# Altium project SixSwitchRectifier.PrjPcb (part 2 of 2)

## Sheet Controller.SchDoc
size A4; SheetNumber: 8; SheetTotal: 8
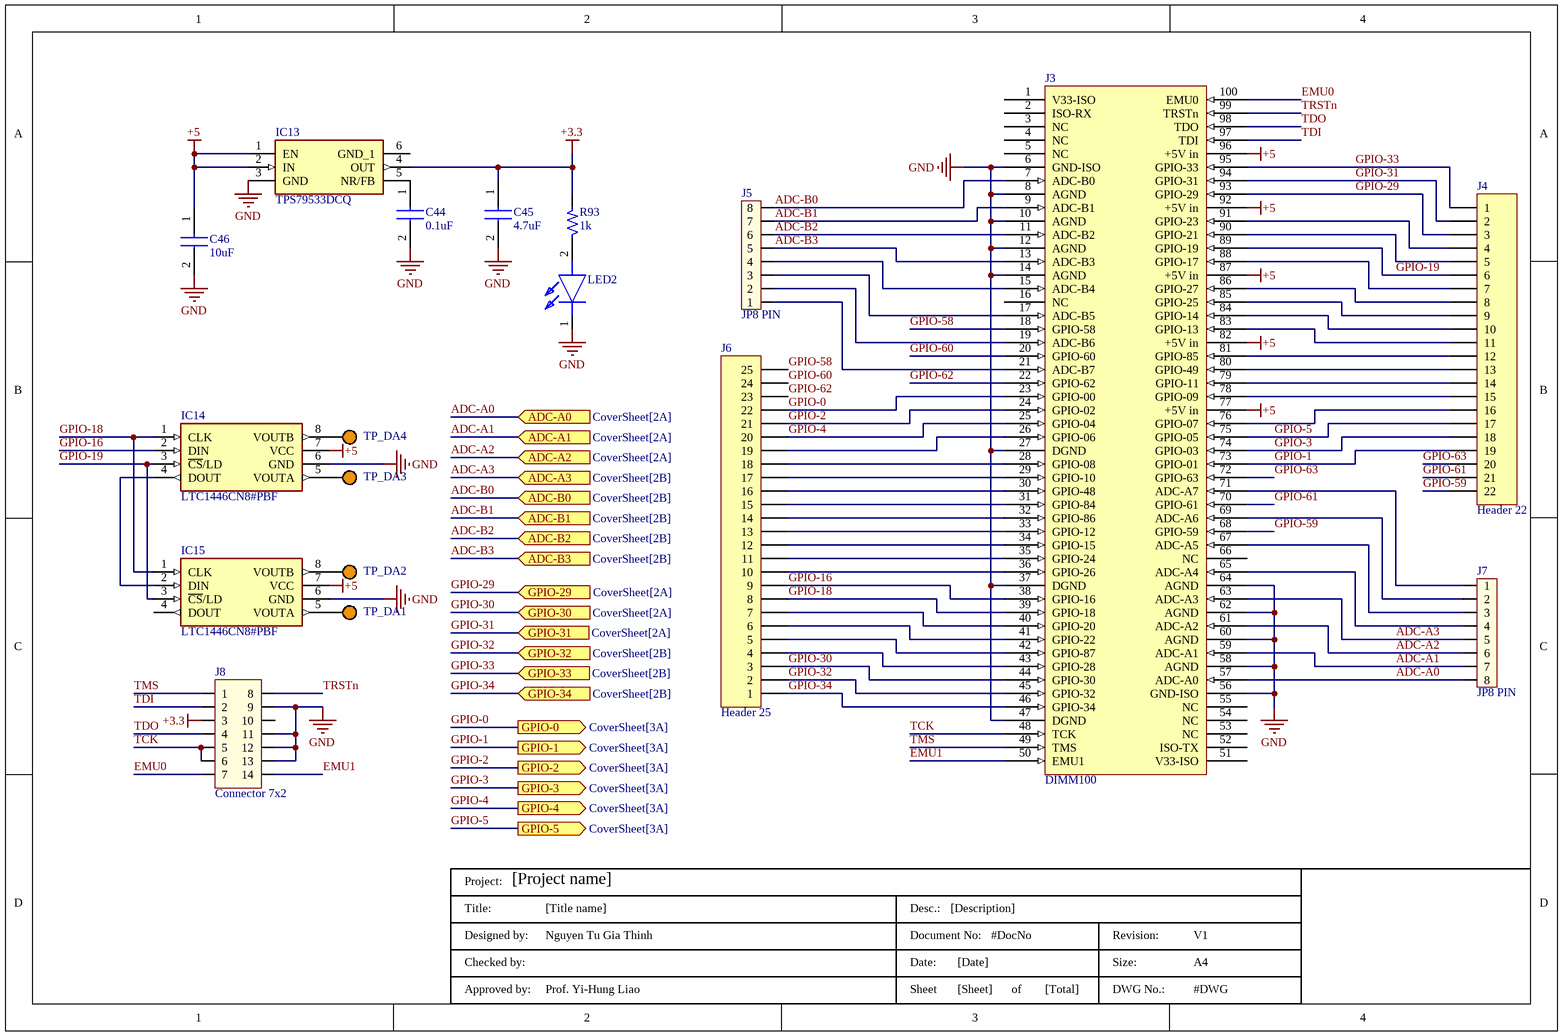
[diagram p7: Controller.SchDoc]

### Parts
(Parts that share a designator on the sheet are numbered #1, #2 ... from top to bottom, then left to right.)
C44  Capacitance: 0.1uF  [C0805]  (hidden comment: C0805C104K3RACTU)
C45  Capacitance: 4.7uF  [CAPC2012X145N]  (hidden comment: 0805B475K250CT)
C46  Capacitance: 10uF  [C1206]  (hidden comment: C1206C106K3RACTU)
IC13  TPS79533DCQ  [SOT127P706X180-6N]
IC14  LTC1446CN8#PBF  [DIP794W53P254L1016H394Q8N]
IC15  LTC1446CN8#PBF  [DIP794W53P254L1016H394Q8N]
J3  DIMM100  [DIMM100]
J4  Header 22  [HDR1X22]
J5  JP8 PIN  [JP8]
J6  Header 25  [HDR1X25]
J7  JP8 PIN  [JP8]
J8  Connector 7x2  [JP7X2]
LED2  150080VS75000  [LEDC2012X80N]  (value not drawn)
R93  1k  [SM-1206]
TitleBlock#8  DWG No.: #DWG  Size:: A4  Revision:: V1  Total of Sheets: [Total]  Sheet: [Sheet]  Date:: [Date]  Document No:: #DocNo  Desc.:: [Description]  Approved by:: Prof. Yi-Hung Liao  Designed by:: Nguyen Tu Gia Thinh  Title:: [Title name]  Project: [Project name]  (hidden comment: TitleBlock)  (graphical)
TP_DA1  (no value)  [5003]
TP_DA2  (no value)  [5003]
TP_DA3  (no value)  [5003]
TP_DA4  (no value)  [5003]

### Ports
ADC-A0 (in, see CoverSheet[2A]), ADC-A1 (in, see CoverSheet[2A]), ADC-A2 (in, see CoverSheet[2A]), ADC-A3 (in, see CoverSheet[2B]), ADC-B0 (in, see CoverSheet[2B]), ADC-B1 (in, see CoverSheet[2B]), ADC-B2 (in, see CoverSheet[2B]), ADC-B3 (in, see CoverSheet[2B]), GPIO-0 (out, see CoverSheet[3A]), GPIO-1 (out, see CoverSheet[3A]), GPIO-2 (out, see CoverSheet[3A]), GPIO-3 (out, see CoverSheet[3A]), GPIO-4 (out, see CoverSheet[3A]), GPIO-5 (out, see CoverSheet[3A]), GPIO-29 (in, see CoverSheet[2A]), GPIO-30 (in, see CoverSheet[2A]), GPIO-31 (in, see CoverSheet[2A]), GPIO-32 (in, see CoverSheet[2B]), GPIO-33 (in, see CoverSheet[2B]), GPIO-34 (in, see CoverSheet[2B])

### Nets
+3.3: C45.1 IC13.4(OUT) J8.3 R93.2
+5: C46.1 IC13.1(EN) IC13.2(IN) IC14.7(VCC) IC15.7(VCC) J3.77(+5V_in) J3.82(+5V_in) J3.87(+5V_in) J3.92(+5V_in) J3.96(+5V_in)
GND: C44.2 C45.2 C46.2 IC13.3(GND) IC14.6(GND) IC15.6(GND) J3.6(GND-ISO) J3.8(AGND) J3.10(AGND) J3.12(AGND) J3.14(AGND) J3.27(DGND) J3.37(DGND) J3.47(DGND) J3.56(GND-ISO) J3.58(AGND) J3.60(AGND) J3.62(AGND) J3.64(AGND) J8.9 J8.11 J8.12 J8.13 LED2.1(K)
ADC-A0: J3.57(ADC-A0) J7.8 ; port ADC-A0
ADC-A1: J3.59(ADC-A1) J7.7 ; port ADC-A1
ADC-A2: J3.61(ADC-A2) J7.6 ; port ADC-A2
ADC-A3: J3.63(ADC-A3) J7.5 ; port ADC-A3
ADC-B0: J3.7(ADC-B0) J5.8 ; port ADC-B0
ADC-B1: J3.9(ADC-B1) J5.7 ; port ADC-B1
ADC-B2: J3.11(ADC-B2) J5.6 ; port ADC-B2
ADC-B3: J3.13(ADC-B3) J5.5 ; port ADC-B3
EMU0: J3.100(EMU0) J8.7
EMU1: J3.50(EMU1) J8.14
GPIO-0: J3.23(GPIO-00) J6.22 ; port GPIO-0
GPIO-1: J3.73(GPIO-01) J4.19 ; port GPIO-1
GPIO-2: J3.24(GPIO-02) J6.21 ; port GPIO-2
GPIO-3: J3.74(GPIO-03) J4.18 ; port GPIO-3
GPIO-4: J3.25(GPIO-04) J6.20 ; port GPIO-4
GPIO-5: J3.75(GPIO-05) J4.17 ; port GPIO-5
GPIO-16: IC14.2(DIN) J3.38(GPIO-16) J6.9
GPIO-18: IC14.1(CLK) IC15.1(CLK) J3.39(GPIO-18) J6.8
GPIO-19: IC14.3(~{CS}/LD) IC15.3(~{CS}/LD) J3.89(GPIO-19) J4.6
GPIO-29: J3.93(GPIO-29) J4.3 ; port GPIO-29
GPIO-30: J3.44(GPIO-30) J6.3 ; port GPIO-30
GPIO-31: J3.94(GPIO-31) J4.2 ; port GPIO-31
GPIO-32: J3.45(GPIO-32) J6.2 ; port GPIO-32
GPIO-33: J3.95(GPIO-33) J4.1 ; port GPIO-33
GPIO-34: J3.46(GPIO-34) J6.1 ; port GPIO-34
GPIO-58: J3.18(GPIO-58) J6.25
GPIO-59: J3.68(GPIO-59) J4.22
GPIO-60: J3.20(GPIO-60) J6.24
GPIO-61: J3.70(GPIO-61) J4.21
GPIO-62: J3.22(GPIO-62) J6.23
GPIO-63: J3.72(GPIO-63) J4.20
TCK: J3.48(TCK) J8.5 J8.6
TDI: J3.97(TDI) J8.2
TDO: J3.98(TDO) J8.4
TMS: J3.49(TMS) J8.1
TRSTn: J3.99(TRSTn) J8.8
NetC44_1: C44.1 IC13.5(NR/FB)
NetIC14_4: IC14.4(DOUT) IC15.2(DIN)
NetIC14_5: IC14.5(VOUTA) TP_DA3.1
NetIC14_8: IC14.8(VOUTB) TP_DA4.1
NetIC15_5: IC15.5(VOUTA) TP_DA1.1
NetIC15_8: IC15.8(VOUTB) TP_DA2.1
NetJ3_15: J3.15(ADC-B4) J5.4
NetJ3_17: J3.17(ADC-B5) J5.3
NetJ3_19: J3.19(ADC-B6) J5.2
NetJ3_21: J3.21(ADC-B7) J5.1
NetJ3_26: J3.26(GPIO-06) J6.19
NetJ3_28: J3.28(GPIO-08) J6.18
NetJ3_29: J3.29(GPIO-10) J6.17
NetJ3_30: J3.30(GPIO-48) J6.16
NetJ3_31: J3.31(GPIO-84) J6.15
NetJ3_32: J3.32(GPIO-86) J6.14
NetJ3_33: J3.33(GPIO-12) J6.13
NetJ3_34: J3.34(GPIO-15) J6.12
NetJ3_35: J3.35(GPIO-24) J6.11
NetJ3_36: J3.36(GPIO-26) J6.10
NetJ3_40: J3.40(GPIO-20) J6.7
NetJ3_41: J3.41(GPIO-22) J6.6
NetJ3_42: J3.42(GPIO-87) J6.5
NetJ3_43: J3.43(GPIO-28) J6.4
NetJ3_65: J3.65(ADC-A4) J7.4
NetJ3_67: J3.67(ADC-A5) J7.3
NetJ3_69: J3.69(ADC-A6) J7.2
NetJ3_71: J3.71(ADC-A7) J7.1
NetJ3_76: J3.76(GPIO-07) J4.16
NetJ3_78: J3.78(GPIO-09) J4.15
NetJ3_79: J3.79(GPIO-11) J4.14
NetJ3_80: J3.80(GPIO-49) J4.13
NetJ3_81: J3.81(GPIO-85) J4.12
NetJ3_83: J3.83(GPIO-13) J4.11
NetJ3_84: J3.84(GPIO-14) J4.10
NetJ3_85: J3.85(GPIO-25) J4.9
NetJ3_86: J3.86(GPIO-27) J4.8
NetJ3_88: J3.88(GPIO-17) J4.7
NetJ3_90: J3.90(GPIO-21) J4.5
NetJ3_91: J3.91(GPIO-23) J4.4
NetLED2_2: LED2.2(A) R93.1

Not connected (* = marked no-connect by the designer): IC13 6(GND_1); IC15 4(DOUT); J3 1(V33-ISO) 2(ISO-RX) 3(NC) 4(NC) 5(NC) 16(NC) 51(V33-ISO) 52(ISO-TX) 53(NC) 54(NC) 55(NC) 66(NC); J8 10

### Notes on the sheet
- (in symbol Title Block 2) Project:; Title:; Desc.:; Designed by:; Document No:; Revision:; Checked by:; Date:; Size:; Approved by:; Sheet; of; DWG No.:

### Library data of the parts
C44 = C0805C104K3RACTU: Capacitor; Manufacturer_Name: KEMET; Datasheet Link: https://content.kemet.com/datasheets/KEM_C1002_X7R_SMD.pdf; Height: 1.1mm; Manufacturer_Part_Number: C0805C104K3RACTU; Mouser Part Number: 80-C0805C104K3R; Mouser Price/Stock: https://www.mouser.co.uk/ProductDetail/KEMET/C0805C104K3RACTU?qs=zZwvocWqSRjmUvfNxkIN%2Fg%3D%3D; Arrow Part Number: C0805C104K3RACTU; Arrow Price/Stock: https://www.arrow.com/en/products/c0805c104k3ractu/kemet-corporation
C45 = 0805B475K250CT: Capacitor; Manufacturer_Name: Walsin Technology Corporation; Datasheet Link: https://componentsearchengine.com/Datasheets/1/0805B475K250CT.pdf; Height: 1.45mm; Manufacturer_Part_Number: 0805B475K250CT; Mouser Part Number: 791-0805B475K250CT; Mouser Price/Stock: https://www.mouser.co.uk/ProductDetail/Walsin/0805B475K250CT?qs=wUXugUrL1qxIBI5FE1x32g%3D%3D
C46 = C1206C106K3RACTU: Capacitor; Manufacturer_Name: KEMET; Datasheet Link: https://content.kemet.com/datasheets/KEM_C1002_X7R_SMD.pdf; Manufacturer_Part_Number: C1206C106K3RACTU; Mouser Part Number: 80-C1206C106K3R; Mouser Price/Stock: https://www.mouser.co.uk/ProductDetail/KEMET/C1206C106K3RACTU?qs=iP0bYSAMAFrasEXHZohwqw%3D%3D; Arrow Part Number: C1206C106K3RACTU; Arrow Price/Stock: https://www.arrow.com/en/products/c1206c106k3ractu/kemet-corporation?region=nac
IC13 = TPS79533DCQ: Integrated Circuit; Manufacturer_Name: Texas Instruments; Datasheet Link: https://datasheet.datasheetarchive.com/originals/distributors/Datasheets-SFU2/DSASFU100034063.pdf; Height: 1.8mm; Manufacturer_Part_Number: TPS79533DCQ; Mouser Part Number: 595-TPS79533DCQ; Mouser Price/Stock: https://www.mouser.co.uk/ProductDetail/Texas-Instruments/TPS79533DCQ?qs=0O%2FZFlpUpJU8SL7TK1VVHw%3D%3D; Arrow Part Number: TPS79533DCQ; Arrow Price/Stock: https://www.arrow.com/en/products/tps79533dcq/texas-instruments?region=nac
IC14 IC15 = LTC1446CN8#PBF: Integrated Circuit; Manufacturer_Name: Analog Devices; Datasheet Link: https://datasheet.datasheetarchive.com/originals/distributors/SFDatasheet-4/sf-00091394.pdf; Height: 3.935mm; Manufacturer_Part_Number: LTC1446CN8#PBF; Mouser Part Number: 584-LTC1446CN8#PBF; Mouser Price/Stock: https://www.mouser.com/Search/Refine.aspx?Keyword=584-LTC1446CN8%23PBF; Arrow Part Number: LTC1446CN8#PBF; Arrow Price/Stock: https://www.arrow.com/en/products/ltc1446cn8pbf/linear-technology
J3 = DIMM100: DM - Series DIMM Sockets vertical type 100-pin
J4 = Header 22: Header, 22-Pin; LatestRevisionDate: 17-Jul-2002; LatestRevisionNote: Re-released for DXP Platform.; Publisher: Altium Limited
J5 J7 = JP8: Value: JP7
J6 = Header 25: Header, 25-Pin; LatestRevisionDate: 17-Jul-2002; LatestRevisionNote: Re-released for DXP Platform.; Publisher: Altium Limited
J8 = JP7x2: Value: Connector 7x2
LED2 = 150080VS75000: LED; Manufacturer_Name: Wurth Elektronik; Datasheet Link: http://katalog.we-online.com/led/datasheet/150080VS75000.pdf; Height: 0.8mm; Manufacturer_Part_Number: 150080VS75000; Mouser Part Number: 710-150080VS75000; Mouser Price/Stock: https://www.mouser.co.uk/ProductDetail/Wurth-Elektronik/150080VS75000?qs=LlUlMxKIyB0tGHJmO6%252B0ug%3D%3D
R93 = R: Resistor 1/4W; Value: R1/4W - 1K
TitleBlock#8 = Title Block 2
TP_DA1-TP_DA4 = 5003: Test Point Orrange, Multipurpose, TH

## Nets that join several sheets
0V_In: CoverSheet (J1.2 J2.2 JDC1.2), PowerManagement (10 pins)
0V_ISO_A1: PowerManagement (C32.2 C35.2 PS4.8), GateDriverSketch (C1.2 IC1.14 R1.2 TP_S1.1), MainCircuit (Q1.3)
0V_ISO_A2: PowerManagement (C33.2 C36.2 PS5.8), GateDriverSketch (C5.2 IC2.14 R6.2 TP_S3.1), MainCircuit (Q2.3)
0V_ISO_A3: PowerManagement (C34.2 C37.2 PS6.8), GateDriverSketch (C9.2 IC3.14 R11.2 TP_S5.1), MainCircuit (Q3.3)
0V_ISO_B1: PowerManagement (C38.2 C40.2 PS7.8), GateDriverSketch (C4.2 IC1.9 R5.2 TP_S2.1), MainCircuit (Q1.7)
0V_ISO_B2: PowerManagement (C39.2 C41.2 PS8.8), GateDriverSketch (C8.2 IC2.9 R10.2 TP_S4.1), MainCircuit (Q2.7)
0V_ISO_B3: PowerManagement (C42.2 C43.2 PS9.8), GateDriverSketch (C12.2 IC3.9 R15.2 TP_S6.1), MainCircuit (Q3.7)
+3.3: PowerManagement (C29.1 L2.2 R92.2), Controller (C45.1 IC13.4 J8.3 R93.2)
+5: PowerManagement (C31.1 L3.2), Controller (10 pins)
+15: PowerManagement (C26.1 L1.2), InputVoltageSensingSketch (8 pins), InputCurrentSensingSketch (8 pins), OutputVoltageSensingSketch (U7.3 U8.3)
+15_ISO_A1: PowerManagement (C35.1 L4.2), GateDriverSketch (C1.1 IC1.16)
+15_ISO_A3: PowerManagement (C37.1 L6.2), GateDriverSketch (C9.1 IC3.16)
+15_ISO_B1: PowerManagement (C40.1 L7.2), GateDriverSketch (C4.1 IC1.11)
+15_ISO_B2: PowerManagement (C41.1 L8.2), GateDriverSketch (C8.1 IC2.11)
+15_ISO_B3: PowerManagement (C43.1 L9.2), GateDriverSketch (C12.1 IC3.11)
+48V_In: CoverSheet (J1.1 J2.1 JDC1.1), PowerManagement (10 pins)
-15: PowerManagement (PS1.10), InputVoltageSensingSketch (8 pins), InputCurrentSensingSketch (8 pins), OutputVoltageSensingSketch (U7.4 U8.2)
GND: CoverSheet (TP1.1 TP2.1 TP3.1 TP4.1), PowerManagement (10 pins), InputVoltageSensingSketch (30 pins), InputCurrentSensingSketch (30 pins), OutputVoltageSensingSketch (R90.2 R91.2 Z13.2 Z14.2), GateDriverSketch (18 pins), Controller (24 pins)
ADC-A0: InputCurrentSensingSketch (5 pins), Controller (J3.57 J7.8)
ADC-A1: InputCurrentSensingSketch (5 pins), Controller (J3.59 J7.7)
ADC-A2: InputCurrentSensingSketch (5 pins), Controller (J3.61 J7.6)
ADC-A3: OutputVoltageSensingSketch (R90.1 TP_Vdc1.1 U7.2 Z13.1), Controller (J3.63 J7.5)
ADC-B0: InputVoltageSensingSketch (5 pins), Controller (J3.7 J5.8)
ADC-B1: InputVoltageSensingSketch (5 pins), Controller (J3.9 J5.7)
ADC-B2: InputVoltageSensingSketch (5 pins), Controller (J3.11 J5.6)
ADC-B3: OutputVoltageSensingSketch (R91.1 TP_Idc1.1 U8.1 Z14.1), Controller (J3.13 J5.5)
GPIO-0: GateDriverSketch (IC1.1 R2.1 TP_PWM1.1), Controller (J3.23 J6.22)
GPIO-1: GateDriverSketch (IC1.2 R3.1 TP_PWM2.1), Controller (J3.73 J4.19)
GPIO-2: GateDriverSketch (IC2.1 R7.1 TP_PWM3.1), Controller (J3.24 J6.21)
GPIO-3: GateDriverSketch (IC2.2 R8.1 TP_PWM4.1), Controller (J3.74 J4.18)
GPIO-4: GateDriverSketch (IC3.1 R12.1 TP_PWM5.1), Controller (J3.25 J6.20)
GPIO-5: GateDriverSketch (IC3.2 R13.1 TP_PWM6.1), Controller (J3.75 J4.17)
GPIO-29: InputCurrentSensingSketch (D9.1 R25.2 TP_NIA1.1 Z2.1), Controller (J3.93 J4.3)
GPIO-30: InputCurrentSensingSketch (D12.1 R36.2 TP_NIB1.1 Z4.1), Controller (J3.44 J6.3)
GPIO-31: InputCurrentSensingSketch (D15.1 R47.2 TP_NIC1.1 Z6.1), Controller (J3.94 J4.2)
GPIO-32: InputVoltageSensingSketch (D18.1 R60.2 TP_NVA1.1 Z8.1), Controller (J3.45 J6.2)
GPIO-33: InputVoltageSensingSketch (D21.1 R73.2 TP_NVB1.1 Z10.1), Controller (J3.95 J4.1)
GPIO-34: InputVoltageSensingSketch (D24.1 R86.2 TP_NVC1.1 Z12.1), Controller (J3.46 J6.1)
NetC47_1: OutputVoltageSensingSketch (U8.4), MainCircuit (7 pins)
NetC47_2: CoverSheet (CN_N1.1 TP_VN1.1), OutputVoltageSensingSketch (R89.1), MainCircuit (7 pins)
NetCN_N2_1: CoverSheet (CN_N2.1 TP_NP1.1), InputVoltageSensingSketch (R56.1 R69.1 R82.1)
NetCN_P1_1: CoverSheet (CN_P1.1 TP_VP1.1), OutputVoltageSensingSketch (R88.1 U8.5)
NetD1_2: GateDriverSketch (D1.2 R1.1 R98.2 TP_G1.1), MainCircuit (Q1.4)
NetD2_2: GateDriverSketch (D2.2 R5.1 R102.2 TP_G2.1), MainCircuit (Q1.8)
NetD3_2: GateDriverSketch (D3.2 R6.1 R106.2 TP_G3.1), MainCircuit (Q2.4)
NetD4_2: GateDriverSketch (D4.2 R10.1 R110.2 TP_G4.1), MainCircuit (Q2.8)
NetD5_2: GateDriverSketch (D5.2 R11.1 R114.2 TP_G5.1), MainCircuit (Q3.4)
NetD6_2: GateDriverSketch (D6.2 R15.1 R118.2 TP_G6.1), MainCircuit (Q3.8)
NetL10_1: InputCurrentSensingSketch (U1.5), MainCircuit (L10.1)
NetL11_1: InputCurrentSensingSketch (U2.5), MainCircuit (L11.1)
NetL12_1: InputCurrentSensingSketch (U3.5), MainCircuit (L12.1)
NetR53_1: CoverSheet (TP_VLA1.1 XF1.2), InputVoltageSensingSketch (R53.1), InputCurrentSensingSketch (U1.4)
NetR66_1: CoverSheet (TP_VLB1.1 XF2.2), InputVoltageSensingSketch (R66.1), InputCurrentSensingSketch (U2.4)
NetR79_1: CoverSheet (TP_VLC1.1 XF3.2), InputVoltageSensingSketch (R79.1), InputCurrentSensingSketch (U3.4)